# Altium project Robot_STM32_Board.PrjPcb
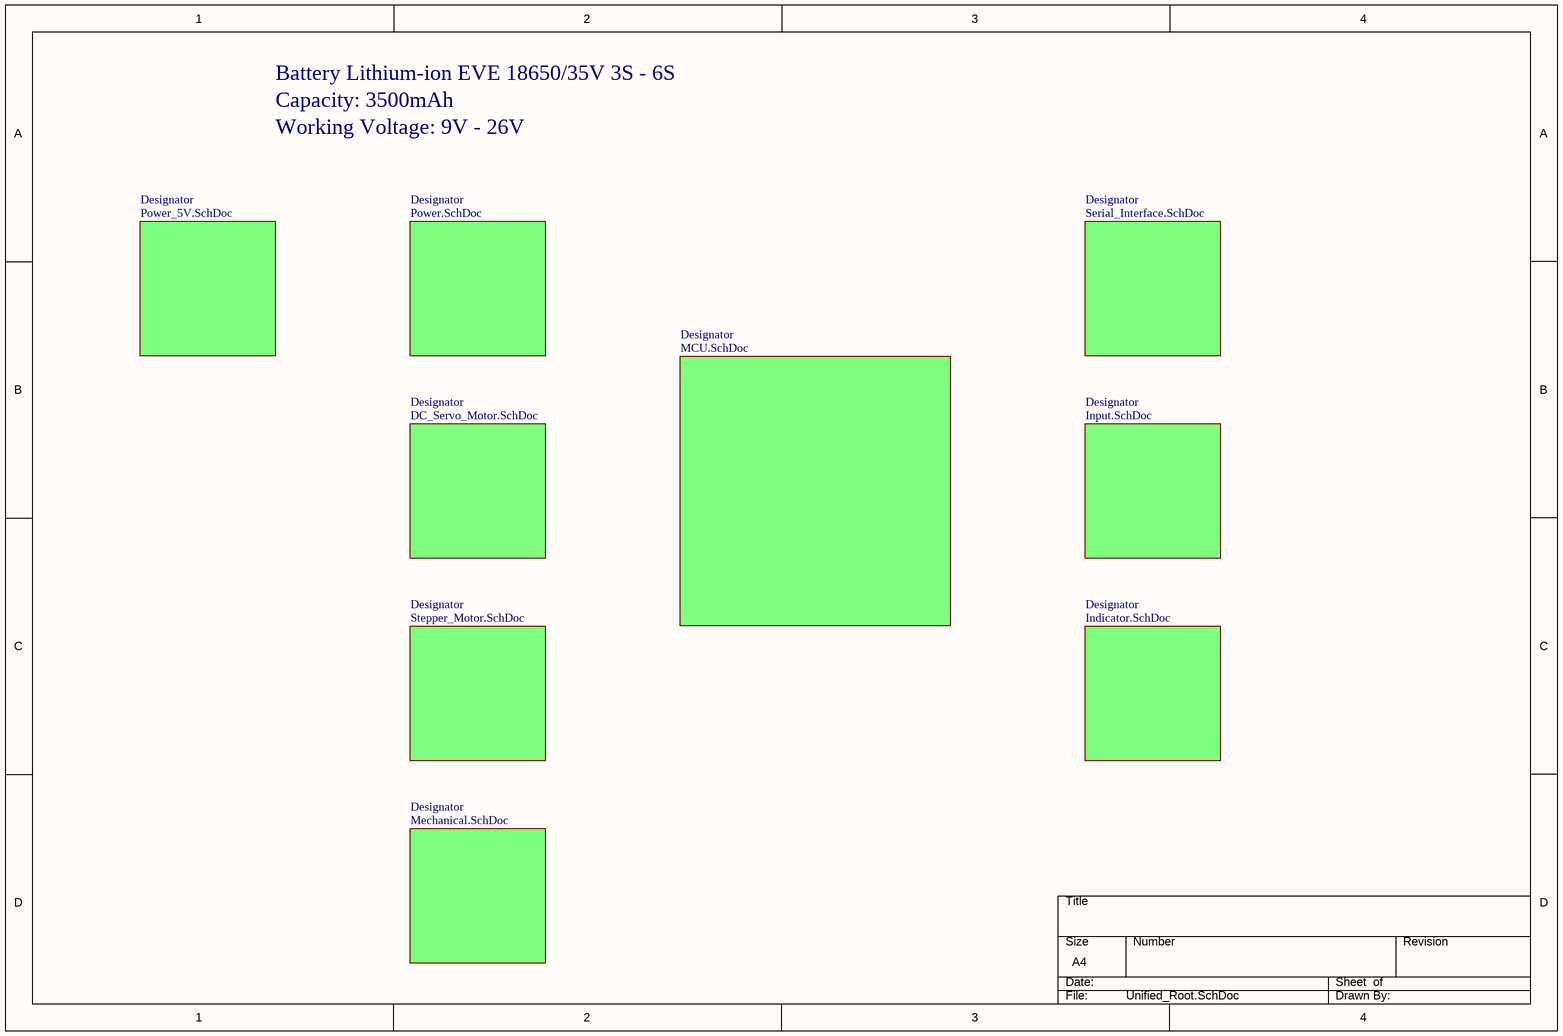
[diagram p0: Unified_Root.SchDoc]
10 sheets, 55 parts. Net scope: global (net labels, ports and power ports of the same name join across sheets).
Sheets:
  Unified_Root.SchDoc
    Designator = Power.SchDoc
    Designator = MCU.SchDoc
    Designator = DC_Servo_Motor.SchDoc
    Designator = Stepper_Motor.SchDoc
    Designator = Indicator.SchDoc
    Designator = Input.SchDoc
    Designator = Serial_Interface.SchDoc
    Designator = Mechanical.SchDoc
    Designator = Power_5V.SchDoc

## Sheet Unified_Root.SchDoc
size A4; Organization: ORGANIZATION; Address1: ADDRESS 1; Address2: ADDRESS 2; Address3: ADDRESS 3; Address4: ADDRESS 4; Revision: -; SheetNumber: 1; SheetTotal: 9; ENG_APP_DATE: --/--/--; DSN_APP_DATE: --/--/--; CHK_APP_DATE: --/--/--

### Sub-sheets
Designator = Power.SchDoc: no entries
Designator = MCU.SchDoc: no entries
Designator = DC_Servo_Motor.SchDoc: no entries
Designator = Stepper_Motor.SchDoc: no entries
Designator = Indicator.SchDoc: no entries
Designator = Input.SchDoc: no entries
Designator = Serial_Interface.SchDoc: no entries
Designator = Mechanical.SchDoc: no entries
Designator = Power_5V.SchDoc: no entries

### Notes on the sheet
- Battery Lithium-ion EVE 18650/35V 3S - 6S
- Capacity: 3500mAh
- Working Voltage: 9V - 26V

## Sheet Power.SchDoc
size A4; Organization: ORGANIZATION; Address1: ADDRESS 1; Address2: ADDRESS 2; Address3: ADDRESS 3; Address4: ADDRESS 4; Revision: -; SheetNumber: 2; SheetTotal: 10; ENG_APP_DATE: --/--/--; DSN_APP_DATE: --/--/--; CHK_APP_DATE: --/--/--
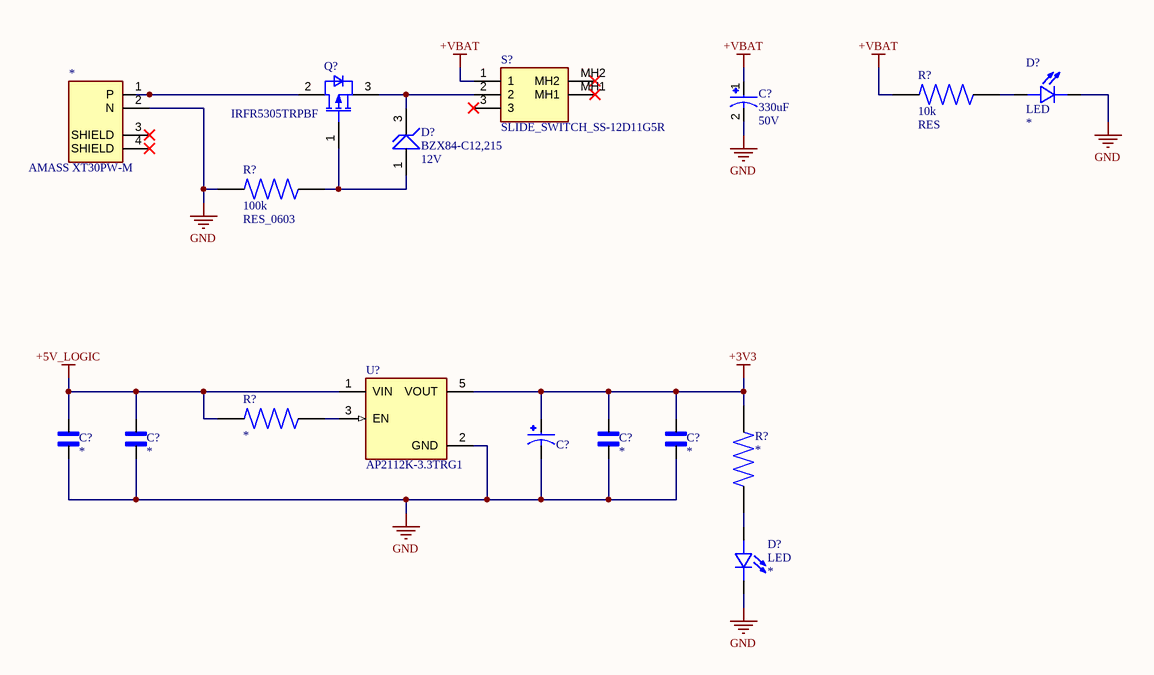
[diagram p1: Power.SchDoc]

### Parts
(Parts that share a designator on the sheet are numbered #1, #2 ... from top to bottom, then left to right.)
*  AMASS XT30PW-M  [AMASS_XT30PW-M]
C?#1  value 330uF  Voltage Rating: 50V  [P_CAP_10X10.2]  (hidden comment: P_CAP)
C?#2  P_CAP  [P_CAP_6.3x5.8]  (value not drawn)
C?#3  N_P_CAP  [N_P_CAP_0402]  (value not drawn)
C?#4  N_P_CAP  [N_P_CAP_0402]  (value not drawn)
C?#5  N_P_CAP  [N_P_CAP_0402]  (value not drawn)
C?#6  N_P_CAP  [N_P_CAP_0402]  (value not drawn)
D?#1  LED  [LED_0603]
D?#2  BZX84-C12,215  Zener Voltage: 12V  [SOT-23]
D?#3  LED  [LED_0603]
Q?  IRFR5305TRPBF  [PG-TO252-3]
R?#1  RES  value 10k  [RES_0603]
R?#2  RES_0603  value 100k  [RES_0603]
R?#3  RES  [RES_0603]  (value not drawn)
R?#4  RES  [RES_0603]  (value not drawn)
S?  SLIDE_SWITCH_SS-12D11G5R  [SLIDE_SWITCH_SS-12D11G5R]
U?#1  AP2112K-3.3TRG1  [SOT95P285X140-5N]

### Nets
+3V3: C?#2.1 C?#5.2 C?#6.2 R?#4.1 U?#1.5(VOUT)
+5V_LOGIC: C?#3.2 C?#4.2 R?#3.1 U?#1.1(VIN)
+VBAT: C?#1.1 R?#1.2 S?.1
GND: *.2(N) C?#1.2 C?#2.2 C?#3.1 C?#4.1 C?#5.1 C?#6.1 D?#1.1(C) D?#3.1(C) R?#2.2 U?#1.2(GND)
Net*_1: *.1(P) Q?.2(DRAIN)
NetD?#1_2: D?#1.2(A) R?#1.1
NetD?#2_1: D?#2.1(A) Q?.1(GATE) R?#2.1
NetD?#2_3: D?#2.3(C) Q?.3(SOURCE) S?.2
NetD?#3_2: D?#3.2(A) R?#4.2
NetR?#3_2: R?#3.2 U?#1.3(EN)

Not connected (* = marked no-connect by the designer): * 3(SHIELD)* 4(SHIELD)*; S? 3* MH1* MH2*

### Notes on the sheet
- DWG. NO.
- REV.
- SHT.
- THIS DOCUMENT AND THE DATA DISCLOSED HEREIN OR HEREWITH IS THE PROPERTY OF ALTIUM LIMITED AND MAY BE FREELY DISTRIBUTED IN WHOLE. NO RIGHTS ARE RESERVED OR EXPRESS OR IMPLIED WARANTEE GIVEN.
- REVISION
- DESCRIPTION
- DATE
- APPROVED
- ENG:
- APPROVALS
- PROJECT
- DSN:
- CHK:
- REFERENCE DOCUMENTS
- PROJECT REVISION:
- TITLE
- DOCUMENT REVISION:
- DESIGN ITEM:
- BOM:
- FAB DWG:
- PCB DWG:
- ASSY DWG:
- SCALE:
- SIZE
- B
- CAGE CODE
- FILE NAME
- DWG NO.
- SHEET
- OF
- REV

### Library data of the parts
* = AMASS_PCB_CONNECTOR: GENERIC AMASS PCB CONNECTOR; MF: Amass; LCSC Part Number: *
C?#1 = P_CAP: GENERIC POLARIZED CAP; MPN: EEEFT1H331AP; MF: PANASONIC; LCSC Part Number: C178596; Tolerance: *; Package: SMD,D10xL10.2mm; ESR: *
C?#2 = P_CAP: GENERIC POLARIZED CAP; MF: Panasonic; MP: EEE-FT1V101AP; SnapEDA_Link: https://www.snapeda.com/parts/EEE-FT1V101AP/Panasonic+Electronic+Components/view-part/?ref=snap; Package: RADIAL-2 Panasonic; Value: *; Check_prices: https://www.snapeda.com/parts/EEE-FT1V101AP/Panasonic+Electronic+Components/view-part/?ref=eda
C?#3-C?#6 = N_P_CAP: GENERIC NON-POLARIZED CAP; Package: *; Value: *
D?#1 D?#3 = LED: GENERIC LED; MPN: *; Forward Voltage: *; Package: *; Color: *
  D?#1: LCSC Part Number: *; Forward Current: *
D?#2 = ZENER_DIODE: GENERIC ZENER DIODE; Power Dissipation: 250mW; LCSC Part Number: C108437
Q? = MOSFET_P_CHANNEL: GENERIC MOSFET P CHANNEL; Type: P-Channel; LCSC Part Number: *; Drain to Source Voltage: *; Current - Continuous Drain: *; Gate Threshold Voltage: *
R?#1 = RES: GENERIC RES; MPN: RC0603FR-0710KL; Power Rating: 100mW; Tolerance: 1%; Voltage Rating: 75V; Temperature Coefficient: *; Package: 0603; LCSC Part Number: C98220
R?#2 = RES: GENERIC RES; MPN: RC0603FR-07100KL; Power Rating: 75V; Tolerance: 1%; Voltage Rating: 75V; Temperature Coefficient: *; Package: 0603; LCSC Part Number: C14675
R?#3 = RES: GENERIC RES; Power Rating: *; Tolerance: *; MPN: *; Voltage Rating: *; Temperature Coefficient: *; Package: *; Value: *; LCSC Part Number: *
S? = SLIDE_SWITCH_SS-12D11G5R: SLIDE SWITCH SS-12D11G5R; Manufacturer Name: XKB Connectivity; Height: 6.9mm; Manufacturer Part Number: SS-12D11G5R; LCSC Part Number: C388633
U?#1 = AP2112K-3.3TRG1: Linear Voltage Regulator IC Positive Fixed 1 Output 600mA SOT-25; MF: Diodes Inc.; Value: *; Purchase-URL: https://pricing.snapeda.com/search/part/AP2112K-3.3TRG1/?ref=eda; Package: SOT-753 Diodes Inc.; Availability: In Stock; Check_prices: https://www.snapeda.com/parts/AP2112K-3.3TRG1/Diodes+Inc./view-part/?ref=eda; Price: None; SnapEDA_Link: https://www.snapeda.com/parts/AP2112K-3.3TRG1/Diodes+Inc./view-part/?ref=snap; MP: AP2112K-3.3TRG1
R?#4 = RES: Power Rating: *; Tolerance: *; MPN: *; Voltage Rating: *; Temperature Coefficient: *; Package: *; Value: *

## Sheet MCU.SchDoc
size A; SheetNumber: 3; SheetTotal: 3

## Sheet DC_Servo_Motor.SchDoc
size A; SheetNumber: 4; SheetTotal: 4

## Sheet Stepper_Motor.SchDoc
size A; SheetNumber: 5; SheetTotal: 5

## Sheet Indicator.SchDoc
size A; SheetNumber: 8; SheetTotal: 8

## Sheet Input.SchDoc
size A; SheetNumber: 7; SheetTotal: 7

## Sheet Serial_Interface.SchDoc
size A; SheetNumber: 6; SheetTotal: 6

## Sheet Mechanical.SchDoc
size A; SheetNumber: 9; SheetTotal: 9

## Sheet Power_5V.SchDoc
size A; SheetNumber: 3; SheetTotal: 9
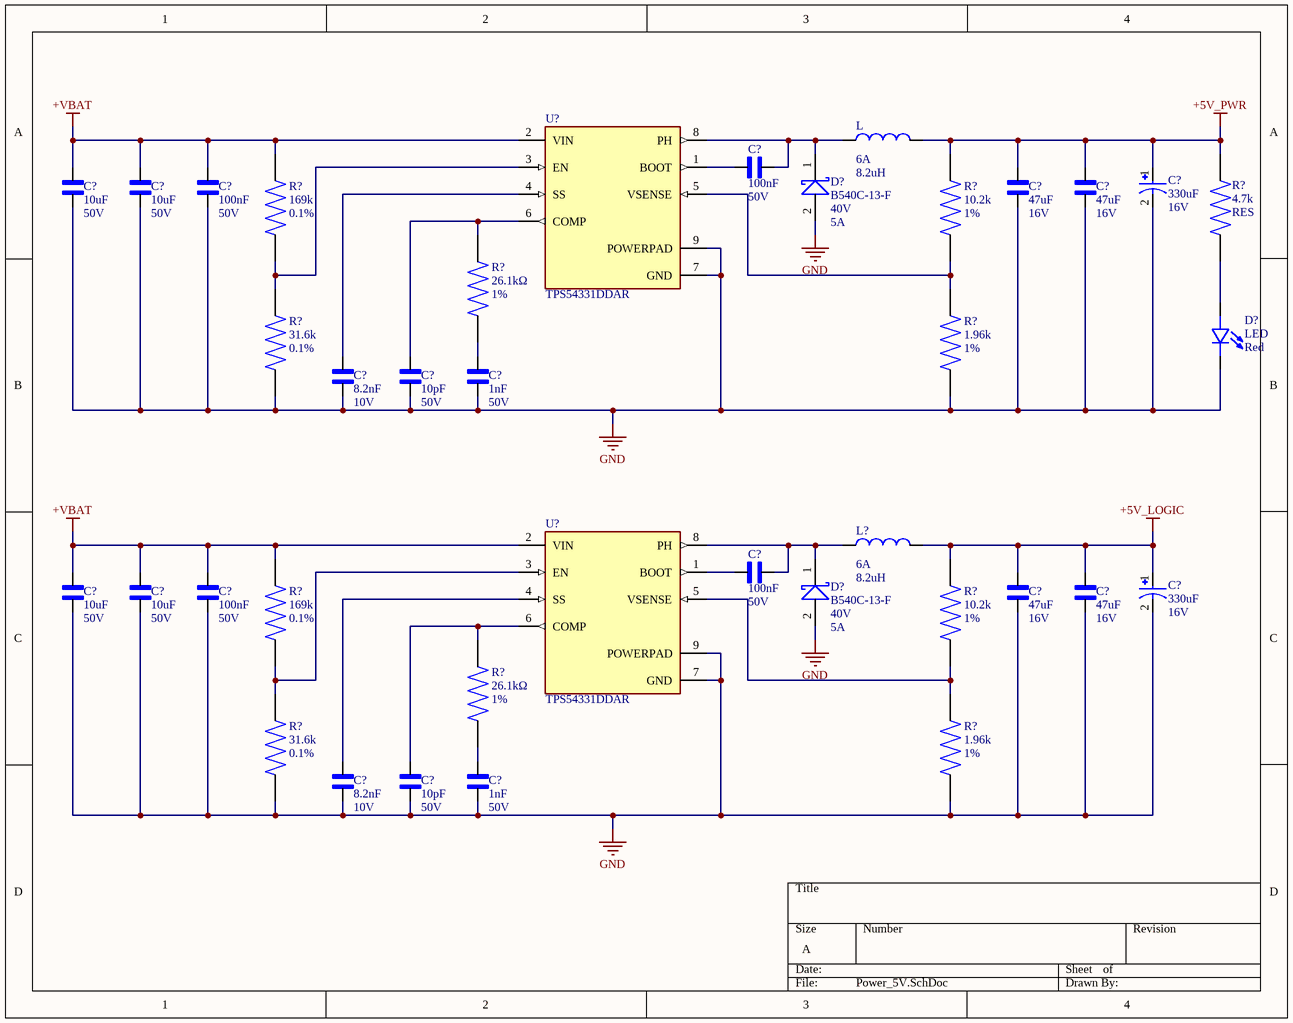
[diagram p2: Power_5V.SchDoc]

### Parts
(Parts that share a designator on the sheet are numbered #1, #2 ... from top to bottom, then left to right.)
C?#7  value 100nF  Voltage Rating: 50V  [N_P_CAP_0402]  (hidden comment: N_P_CAP)
C?#8  value 330uF  Voltage Rating: 16V  [P_CAP_6.3X7.7]  (hidden comment: P_CAP)
C?#9  value 10uF  Voltage Rating: 50V  [N_P_CAP_1206]  (hidden comment: N_P_CAP)
C?#10  value 10uF  Voltage Rating: 50V  [N_P_CAP_1206]  (hidden comment: N_P_CAP)
C?#11  value 100nF  Voltage Rating: 50V  [N_P_CAP_0402]  (hidden comment: N_P_CAP)
C?#12  value 47uF  Voltage Rating: 16V  [N_P_CAP_1210]  (hidden comment: N_P_CAP)
C?#13  value 47uF  Voltage Rating: 16V  [N_P_CAP_1210]  (hidden comment: N_P_CAP)
C?#14  value 8.2nF  Voltage Rating: 10V  [N_P_CAP_0201]  (hidden comment: N_P_CAP)
C?#15  value 10pF  Voltage Rating: 50V  [N_P_CAP_0805]  (hidden comment: N_P_CAP)
C?#16  value 1nF  Voltage Rating: 50V  [N_P_CAP_0402]  (hidden comment: N_P_CAP)
C?#17  value 100nF  Voltage Rating: 50V  [N_P_CAP_0402]  (hidden comment: N_P_CAP)
C?#18  value 330uF  Voltage Rating: 16V  [P_CAP_6.3X7.7]  (hidden comment: P_CAP)
C?#19  value 10uF  Voltage Rating: 50V  [N_P_CAP_1206]  (hidden comment: N_P_CAP)
C?#20  value 10uF  Voltage Rating: 50V  [N_P_CAP_1206]  (hidden comment: N_P_CAP)
C?#21  value 100nF  Voltage Rating: 50V  [N_P_CAP_0402]  (hidden comment: N_P_CAP)
C?#22  value 47uF  Voltage Rating: 16V  [N_P_CAP_1210]  (hidden comment: N_P_CAP)
C?#23  value 47uF  Voltage Rating: 16V  [N_P_CAP_1210]  (hidden comment: N_P_CAP)
C?#24  value 8.2nF  Voltage Rating: 10V  [N_P_CAP_0201]  (hidden comment: N_P_CAP)
C?#25  value 10pF  Voltage Rating: 50V  [N_P_CAP_0805]  (hidden comment: N_P_CAP)
C?#26  value 1nF  Voltage Rating: 50V  [N_P_CAP_0402]  (hidden comment: N_P_CAP)
D?#4  B540C-13-F  Voltage - DC Reverse: 40V  Current - Rectified: 5A  [DO-214AB]
D?#5  LED  Color: Red  [LED_0603]
D?#6  B540C-13-F  Voltage - DC Reverse: 40V  Current - Rectified: 5A  [DO-214AB]
L  value 8.2uH  Current - Saturation: 6A  [INDUCTOR_7X6.6]  (hidden comment: FXL0630-8R2-M)
L?  value 8.2uH  Current - Saturation: 6A  [INDUCTOR_7X6.6]  (hidden comment: FXL0630-8R2-M)
R?#5  value 169k  Tolerance: 0.1%  [RES_0402]  (hidden comment: RES)
R?#6  value 10.2k  Tolerance: 1%  [RES_0402]  (hidden comment: RES)
R?#7  RES  value 4.7k  [RES_0603]
R?#8  value 26.1kΩ  Tolerance: 1%  [RES_0402]  (hidden comment: RES)
R?#9  value 31.6k  Tolerance: 0.1%  [RES_0402]  (hidden comment: RES)
R?#10  value 1.96k  Tolerance: 1%  [RES_0402]  (hidden comment: RES)
R?#11  value 169k  Tolerance: 0.1%  [RES_0402]  (hidden comment: RES)
R?#12  value 10.2k  Tolerance: 1%  [RES_0402]  (hidden comment: RES)
R?#13  value 26.1kΩ  Tolerance: 1%  [RES_0402]  (hidden comment: RES)
R?#14  value 31.6k  Tolerance: 0.1%  [RES_0402]  (hidden comment: RES)
R?#15  value 1.96k  Tolerance: 1%  [RES_0402]  (hidden comment: RES)
U?#2  TPS54331DDAR  [CONV_TPS54331DDAR]
U?#3  TPS54331DDAR  [CONV_TPS54331DDAR]

### Nets
+5V_LOGIC: C?#18.1 C?#22.2 C?#23.2 L?.2 R?#12.2
+5V_PWR: C?#8.1 C?#12.2 C?#13.2 L.2 R?#6.2 R?#7.2
+VBAT: C?#9.2 C?#10.2 C?#11.2 C?#19.2 C?#20.2 C?#21.2 R?#5.2 R?#11.2 U?#2.2(VIN) U?#3.2(VIN)
GND: C?#8.2 C?#9.1 C?#10.1 C?#11.1 C?#12.1 C?#13.1 C?#14.1 C?#15.1 C?#16.1 C?#18.2 C?#19.1 C?#20.1 C?#21.1 C?#22.1 C?#23.1 C?#24.1 C?#25.1 C?#26.1 D?#4.2(A) D?#5.1(C) D?#6.2(A) R?#9.1 R?#10.1 R?#14.1 R?#15.1 U?#2.7(GND) U?#2.9(POWERPAD) U?#3.7(GND) U?#3.9(POWERPAD)
NetC?#7_1: C?#7.1 D?#4.1(C) L.1 U?#2.8(PH)
NetC?#7_2: C?#7.2 U?#2.1(BOOT)
NetC?#14_2: C?#14.2 U?#2.4(SS)
NetC?#15_2: C?#15.2 R?#8.2 U?#2.6(COMP)
NetC?#16_2: C?#16.2 R?#8.1
NetC?#17_1: C?#17.1 D?#6.1(C) L?.1 U?#3.8(PH)
NetC?#17_2: C?#17.2 U?#3.1(BOOT)
NetC?#24_2: C?#24.2 U?#3.4(SS)
NetC?#25_2: C?#25.2 R?#13.2 U?#3.6(COMP)
NetC?#26_2: C?#26.2 R?#13.1
NetD?#5_2: D?#5.2(A) R?#7.1
NetR?#5_1: R?#5.1 R?#9.2 U?#2.3(EN)
NetR?#6_1: R?#6.1 R?#10.2 U?#2.5(VSENSE)
NetR?#11_1: R?#11.1 R?#14.2 U?#3.3(EN)
NetR?#12_1: R?#12.1 R?#15.2 U?#3.5(VSENSE)

### Library data of the parts
C?#7 C?#11 C?#17 C?#21 = N_P_CAP: GENERIC NON-POLARIZED CAP; MPN: CC0402KRX7R9BB104; MF: YAGEO; Package: 0402; LCSC Part Number: C131394; Tolerance: *; ESR: *
C?#8 C?#18 = P_CAP: GENERIC POLARIZED CAP; MPN: EEEFTC331XAP; MF: *; LCSC Part Number: C413522; Tolerance: *; Package: *; ESR: *
C?#9 C?#10 C?#19 C?#20 = N_P_CAP: GENERIC NON-POLARIZED CAP; MPN: CC1206KKX5R9BB106; MF: YAGEO; Package: 1206; LCSC Part Number: C100122; Tolerance: *; ESR: *
C?#12 C?#13 C?#22 C?#23 = N_P_CAP: GENERIC NON-POLARIZED CAP; MPN: GRM32ER61C476KE15L; Tolerance: 10%; MF: muRata; Package: 1210; LCSC Part Number: C77101; ESR: *
C?#14 C?#24 = N_P_CAP: GENERIC NON-POLARIZED CAP; MPN: GRM033R71A822KA01D; Tolerance: 10%; MF: muRata; Package: 0201; LCSC Part Number: C2168104; ESR: *
C?#15 C?#25 = N_P_CAP: GENERIC NON-POLARIZED CAP; MPN: CC0805JRNPO9BN100; Tolerance: 5%; MF: YAGEO; Package: 0805; LCSC Part Number: C107107; ESR: *
C?#16 C?#26 = N_P_CAP: GENERIC NON-POLARIZED CAP; MPN: GRM1555C1H102JA01J; Tolerance: 5%; MF: muRata; Package: 0402; LCSC Part Number: C2176577; ESR: *
D?#4 D?#6 = SCHOTTKY_DIODE: GENERIC SCHOTTKY DIODE; Voltage - Forward: 550mV@5A; Power Dissipation: *; LCSC Part Number: C72264
D?#5 = LED: GENERIC LED; MPN: *; Forward Voltage: *; Package: *; LCSC Part Number: C965799; Forward Current: *
L L? = INDUCTOR: GENERIC INDUCTOR; MF: cjiang; MPN: FXL0630-8R2-M; Package: SMD,7x6.6mm; LCSC Part Number: C167222; Current Rating: *; DC Resistance: *
R?#5 R?#11 = RES: GENERIC RES; MPN: RT0402BRD07169KL; Power Rating: 62.5mW; Voltage Rating: 50V; Temperature Coefficient: *; Package: 0402; LCSC Part Number: C852555
R?#6 R?#12 = RES: GENERIC RES; MPN: CRCW040210K2FKED; Power Rating: 62.5mW; Voltage Rating: 50V; Temperature Coefficient: 100ppm/*C; Package: 0402; LCSC Part Number: C481923
R?#7 = RES: GENERIC RES; MPN: RC0603FR-074K7L; Power Rating: 100mW; Voltage Rating: 75V; Tolerance: *; Temperature Coefficient: *; Package: 0603; LCSC Part Number: C99782
R?#8 R?#13 = RES: GENERIC RES; MPN: CRCW040226K1FKED; Power Rating: 62.5mW; Temperature Coefficient: 100ppm/*C; Voltage Rating: *; Package: 0402; LCSC Part Number: C3008932
R?#9 R?#14 = RES: GENERIC RES; MPN: RT0402BRD0731K6L; Power Rating: 62.5mW; Voltage Rating: 50V; Temperature Coefficient: 25ppm/*C; Package: 0402; LCSC Part Number: C852720
R?#10 R?#15 = RES: GENERIC RES; MPN: CRCW04021K96FKED; Power Rating: 62.5mW; Voltage Rating: 50V; Temperature Coefficient: 100ppm/*C; Package: 0402; LCSC Part Number: C2092068
U?#2 U?#3 = TPS54331DDAR: 3.5V to 28V Input, 3A, 570kHz Step-Down Converter with Eco-mode; MF: Texas Instruments; SnapEDA_Link: https://www.snapeda.com/parts/TPS54331DDAR/Texas+Instruments/view-part/?ref=snap; Purchase-URL: https://pricing.snapeda.com/search/part/TPS54331DDAR/?ref=eda; Package: HSOIC-8 Texas Instruments; MP: TPS54331DDAR; Price: None; Availability: In Stock; Check_prices: https://www.snapeda.com/parts/TPS54331DDAR/Texas+Instruments/view-part/?ref=eda; Value: *

## Nets that join several sheets
+5V_LOGIC: Power (C?#3.2 C?#4.2 R?#3.1 U?#1.1), Power_5V (5 pins)
+VBAT: Power (C?#1.1 R?#1.2 S?.1), Power_5V (10 pins)
GND: Power (11 pins), Power_5V (29 pins)